# Altium project PhotosensorPCB.PrjPcb
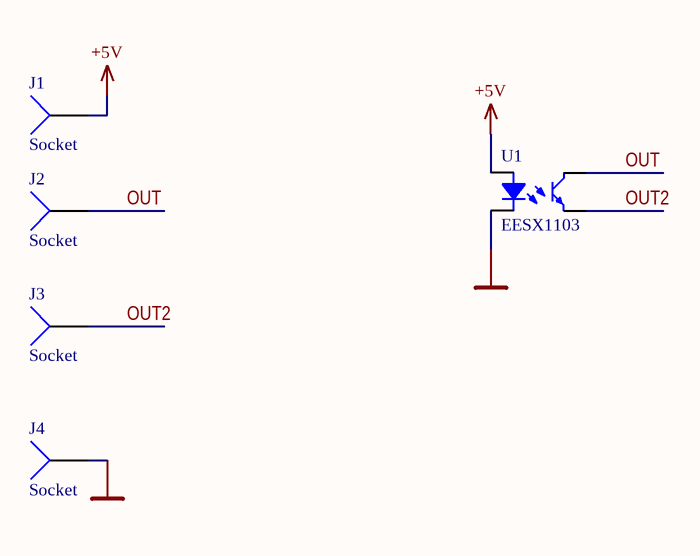
[diagram p0: main.SchDoc]
1 sheet, 5 parts. Net scope: global (net labels, ports and power ports of the same name join across sheets).
Board file: PCB.PcbDoc

## Sheet main.SchDoc
size A4; SheetNumber: 1; SheetTotal: 1

### Parts
J1  Socket  [PIN1]
J2  Socket  [PIN1]
J3  Socket  [PIN1]
J4  Socket  [PIN1]
U1  EESX1103  [EESX1103]

### Nets
+5V: J1.1 U1.1
GND: J4.1 U1.2
OUT: J2.1 U1.4
OUT2: J3.1 U1.3

### Library data of the parts
J1-J4 = Socket: LatestRevisionDate: 17-Jul-2002; LatestRevisionNote: Re-released for DXP Platform.; Publisher: Altium Limited